# EAGLE design birthdaycontrol (EAGLE 6.5.0)
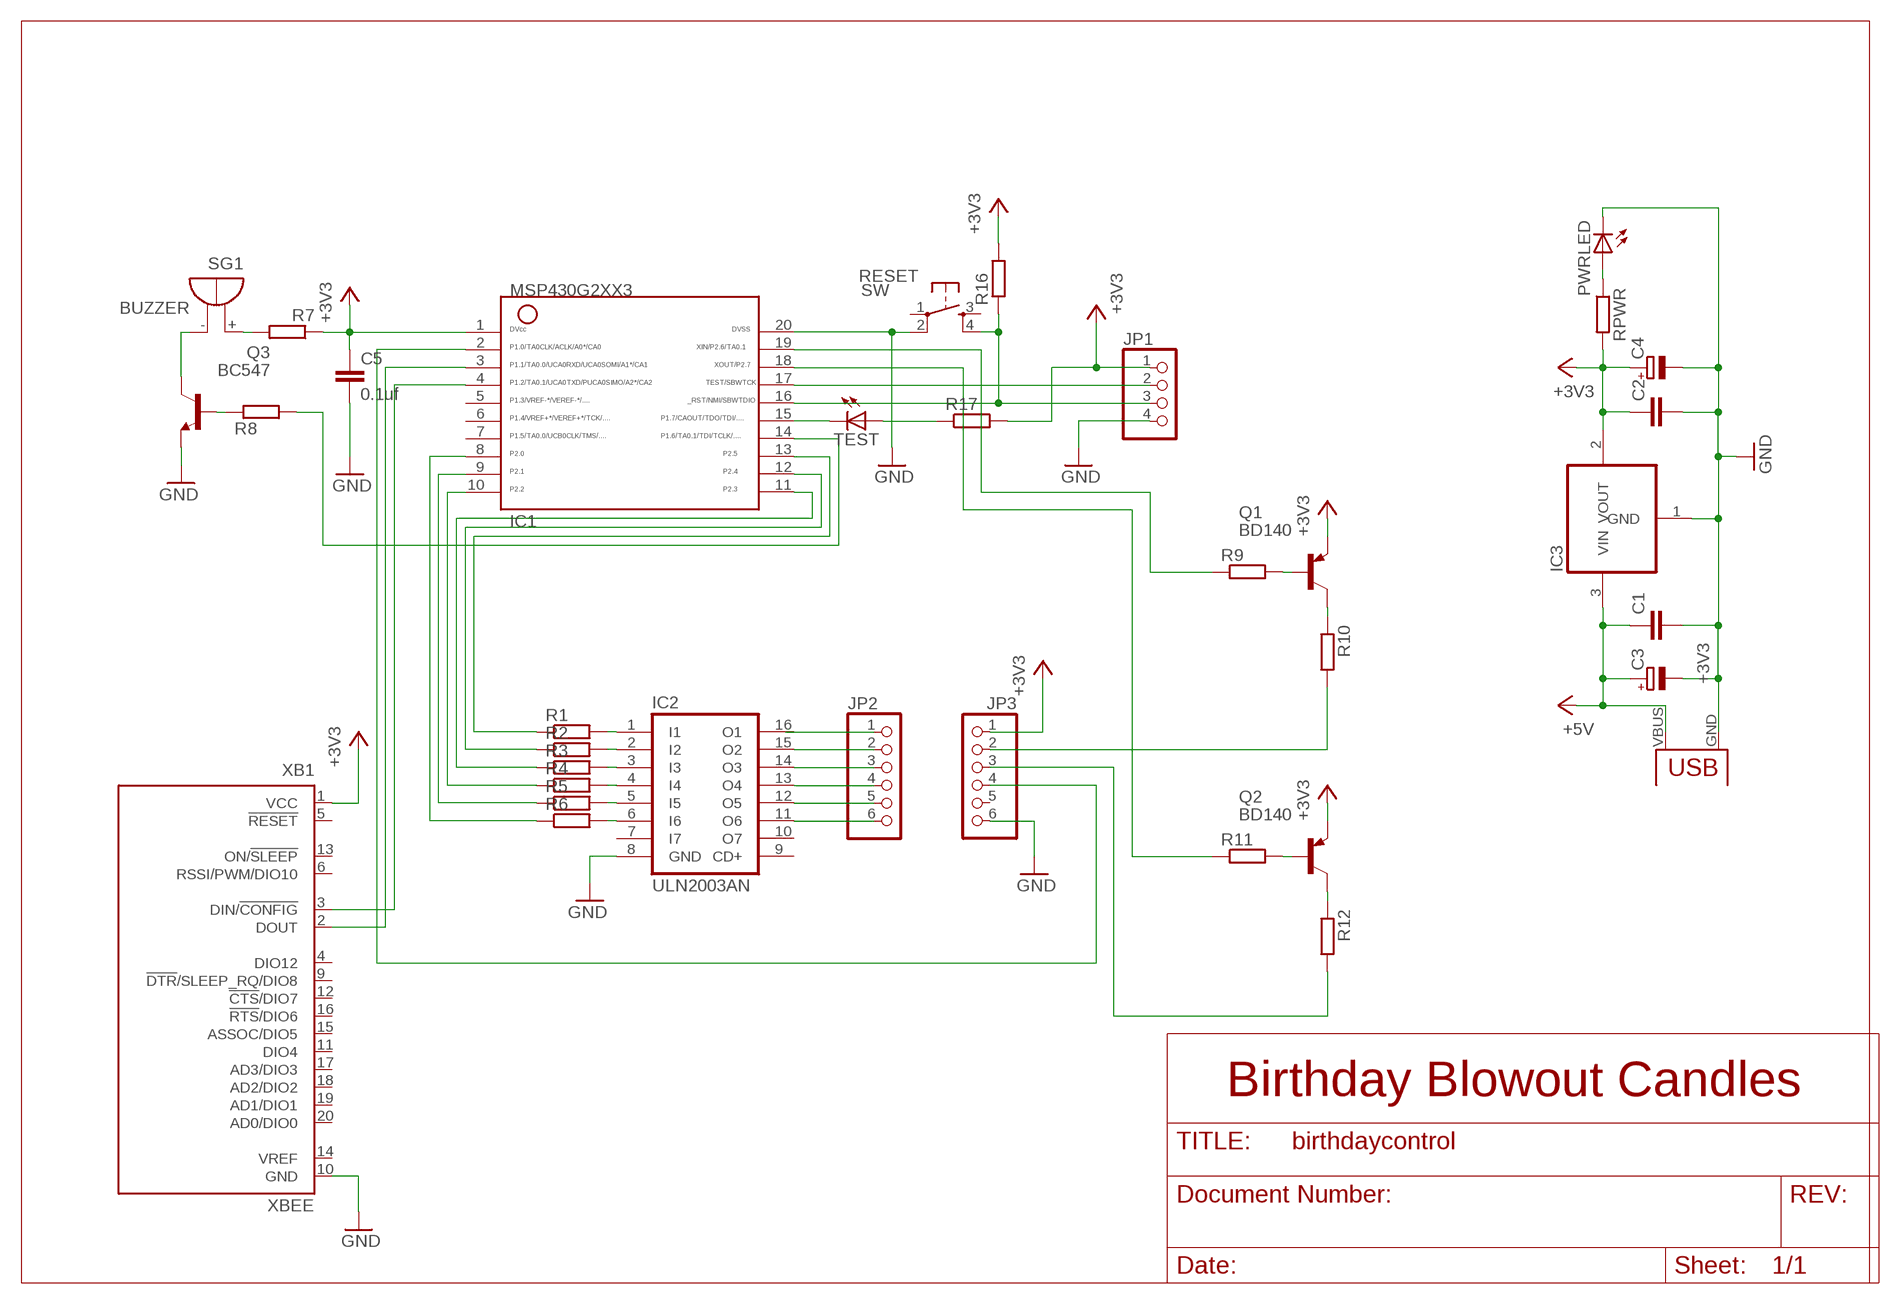
[diagram p0: schematic, sheet 1]

## Parts
C1  C-EU025-025X050  [C025-025X050]
C2  C-EU025-025X050  [C025-025X050]
C3  CPOL-EUE2.5-5  [E2,5-5]
C4  CPOL-EUE2.5-5  [E2,5-5]
C5  0.1uf  C-EU025-025X050  [C025-025X050]
IC1  MSP430  MSP430G2553DIP20  [G2553-DIP20]
IC2  ULN2003AN  [DIL16]
IC3  REG1117  [SOT223]
JP1  PINHD-1X4  [1X04]
JP2  PINHD-1X6  [1X06]
JP3  PINHD-1X6  [1X06]
PWRLED  LED3MM  [LED3MM]
Q1  BD140  [TO126]
Q2  BD140  [TO126]
Q3  BC547  [TO92]
R1  R-EU_0207/7  [0207/7]
R2  R-EU_0207/7  [0207/7]
R3  R-EU_0207/7  [0207/7]
R4  R-EU_0207/7  [0207/7]
R5  R-EU_0207/7  [0207/7]
R6  R-EU_0207/7  [0207/7]
R7  R-EU_0207/7  [0207/7]
R8  R-EU_0207/7  [0207/7]
R9  R-EU_0207/7  [0207/7]
R10  R-EU_0207/7  [0207/7]
R11  R-EU_0207/7  [0207/7]
R12  R-EU_0207/7  [0207/7]
R16  R-EU_0207/7  [0207/7]
R17  R-EU_0207/7  [0207/7]
RESET  SW  OMRON_SWITCH_10-XX  [B3F-10XX]
RPWR  R-EU_0207/7  [0207/7]
SG1  BUZZER  [F/TMB]
TEST  LED3MM  [LED3MM]
U$6  USB(POWER)  [USB(POWER)]
XB1  XBEE  [XBEE]

## Nets
+3V3: C2.1 C4.+ C5.1 IC1.1 IC3.2(VOUT) JP1.1 JP3.1 Q1.1(E) Q2.1(E) R7.1 R16.2 R17.2 RPWR.2 XB1.1(VCC)
+5V: C1.1 C3.+ IC3.3(VIN) U$6.VBUS(VCC)
GND: C1.2 C2.2 C3.- C4.- C5.2 IC1.20 IC2.8(GND) IC3.1(GND) JP1.4 JP3.6 PWRLED.K(C) Q3.1(E) RESET.2(P1) U$6.GND XB1.10(GND)
N$1: IC1.18 R11.1
N$2: IC1.3 XB1.2(DOUT)
N$3: IC2.1(I1) R1.2
N$4: IC2.2(I2) R2.2
N$5: Q1.3(B) R9.2
N$6: Q1.2(C) R10.1
N$7: IC1.15 TEST.K(C)
N$8: R17.1 TEST.A
N$9: IC2.3(I3) R3.2
N$10: Q3.3(C) SG1.-
N$11: IC2.4(I4) R4.2
N$12: R7.2 SG1.+
N$13: IC2.5(I5) R5.2
N$14: IC2.6(I6) R6.2
N$15: IC1.8 R6.1
N$16: IC1.9 R5.1
N$17: IC1.10 R4.1
N$18: IC1.11 R3.1
N$19: Q3.2(B) R8.1
N$20: IC1.12 R2.1
N$21: IC1.13 R1.1
N$22: Q2.3(B) R11.2
N$23: Q2.2(C) R12.1
N$24: IC2.13(O4) JP2.4
N$25: IC1.4 XB1.3(DIN/!CONFIG)
N$26: IC2.16(O1) JP2.1
N$27: IC2.12(O5) JP2.5
N$29: IC1.2 JP3.4
N$31: PWRLED.A RPWR.1
N$35: IC2.15(O2) JP2.2
N$37: IC2.14(O3) JP2.3
N$40: JP3.3 R12.2
N$41: IC2.11(O6) JP2.6
N$43: JP3.2 R10.2
N$68: IC1.19 R9.1
P1.2: IC1.14 R8.2
RST: IC1.16 JP1.3 R16.1 RESET.4(S1)
TEST: IC1.17 JP1.2
Unconnected: IC1.5 IC1.6 IC1.7 IC2.7(I7) IC2.9(CD+) IC2.10(O7) JP3.5 RESET.1(P) RESET.3(S) XB1.4(DIO12) XB1.5(!RESET) XB1.6(RSSI/PWM/DIO10) XB1.9(!DTR!/SLEEP_RQ/DIO8) XB1.11(DIO4) XB1.12(!CTS!/DIO7) XB1.13(ON/!SLEEP) XB1.14(VREF) XB1.15(ASSOC/DIO5) XB1.16(!RTS!/DIO6) XB1.17(AD3/DIO3) XB1.18(AD2/DIO2) XB1.19(AD1/DIO1) XB1.20(AD0/DIO0)

## Notes on the sheet
- Birthday Blowout Candles

## Library data of the parts
C1 C2 C5 = rcl:C-EU: CAPACITOR, European symbol
C3 C4 = resistor:CPOL-EU: POLARIZED CAPACITOR, European symbol
IC1 = CEDT_JANUARY_2015_v5:MSP430G2553
IC2 = uln-udn:ULN2003A: DRIVER ARRAY
IC3 = burr-brown:REG1117: 800mA and 1A Low Dropout (LDO) Positive Regulator 1.8V, 2.5V, 2.85V, 3.3V, 5V, and Adj; MPN: REG1117; OC_FARNELL: 1097566; OC_NEWARK: 14P6981
JP1 = pinhead01:PINHD-1X4: PIN HEADER
JP2 JP3 = pinhead01:PINHD-1X6: PIN HEADER
PWRLED TEST = led:LED: LED OSRAM: - CHIPLED LG R971, LG N971, LY N971, LG Q971, LY Q971, LO R971, LY R971 LH N974, LH R974 LS Q976, LO Q976, LY Q976 LO Q996 - Hyper CHIPLED LW Q18S LB Q993, LB Q99A, LB R99A - SideLED LS A670, LO A670, LY A670, LG A670, LP A670 LB A673, LV A673, LT A673, LW A673 LH A674 LY A675 LS A676, LA A676, LO A676, LY A676, LW A676 LS A679, LY A679, LG A679 - Hyper Micro SIDELED® LS Y876, LA Y876, LO Y876, LY Y876 LT Y87S - SmartLED LW L88C, LW L88S LB L89C, LB L89S, LG L890 LS L89K, LO L89K, LY L89K LS L896, LA L896, LO L896, LY L896 - TOPLED LS T670, LO T670, LY T670, LG T670, LP T670 LSG T670, LSP T670, LSY T670, LOP T670, LYG T670 LG T671, LOG T671, LSG T671 LB T673, LV T673, LT T673, LW T673 LH T674 LS T676, LA T676, LO T676, LY T676, LB T676, LH T676, LSB T676, LW T676 LB T67C, LV T67C, LT T67C, LS T67K, LO T67K, LY T67K, LW E67C LS E67B, LA E67B, LO E67B, LY E67B, LB E67C, LV E67C, LT E67C LW T67C LS T679, LY T679, LG T679 LS T770, LO T770, LY T770, LG T770, LP T770 LB T773, LV T773, LT T773, LW T773 LH T774 LS E675, LA E675, LY E675, LS T675 LS T776, LA T776, LO T776, LY T776, LB T776 LHGB T686 LT T68C, LB T68C - Hyper Mini TOPLED® LB M676 - Mini TOPLED Santana® LG M470 LS M47K, LO M47K, LY M47K Source: http://www.osram.convergy.de LUXEON: - LUMILED® LXK2-PW12-R00, LXK2-PW12-S00, LXK2-PW14-U00, LXK2-PW14-V00 LXK2-PM12-R00, LXK2-PM12-S00, LXK2-PM14-U00 LXK2-PE12-Q00, LXK2-PE12-R00, LXK2-PE12-S00, LXK2-PE14-T00, LXK2-PE14-U00 LXK2-PB12-K00, LXK2-PB12-L00, LXK2-PB12-M00, LXK2-PB14-N00, LXK2-PB14-P00, LXK2-PB14-Q00 LXK2-PR12-L00, LXK2-PR12-M00, LXK2-PR14-Q00, LXK2-PR14-R00 LXK2-PD12-Q00, LXK2-PD12-R00, LXK2-PD12-S00 LXK2-PH12-R00, LXK2-PH12-S00 LXK2-PL12-P00, LXK2-PL12-Q00, LXK2-PL12-R00 Source: www.luxeon.com KINGBRIGHT: KA-3528ASYC Source: www.kingbright.com
Q1 Q2 = transistor-pnp:BD140: PNP Transistor
Q3 = transistor:BC547: NPN TRANSISTOR
R1-R6 = resistor:R-EU_: RESISTOR, European symbol
R7-R12 R16 R17 RPWR = rcl:R-EU_: RESISTOR, European symbol
RESET = CEDT_JANUARY_2015_v5:OMRON_SWITCH
SG1 = CEDT_JANUARY_2015_v5:BUZZER: BUZZER Source: Buerklin; OC_FARNELL: unknown; OC_NEWARK: unknown
U$6 = CEDT_JANUARY_2015_v5:USB(POWER)
XB1 = xbee:XBEE: XBee (TM) /XBee-PRO(TM) OEM RF Modules Source: MaxStream, Inc. xbee_productmanual.pdf; MPN: XBP24-Z7UIT-004; OC_FARNELL: 1751799; OC_NEWARK: 34R5507

## Board
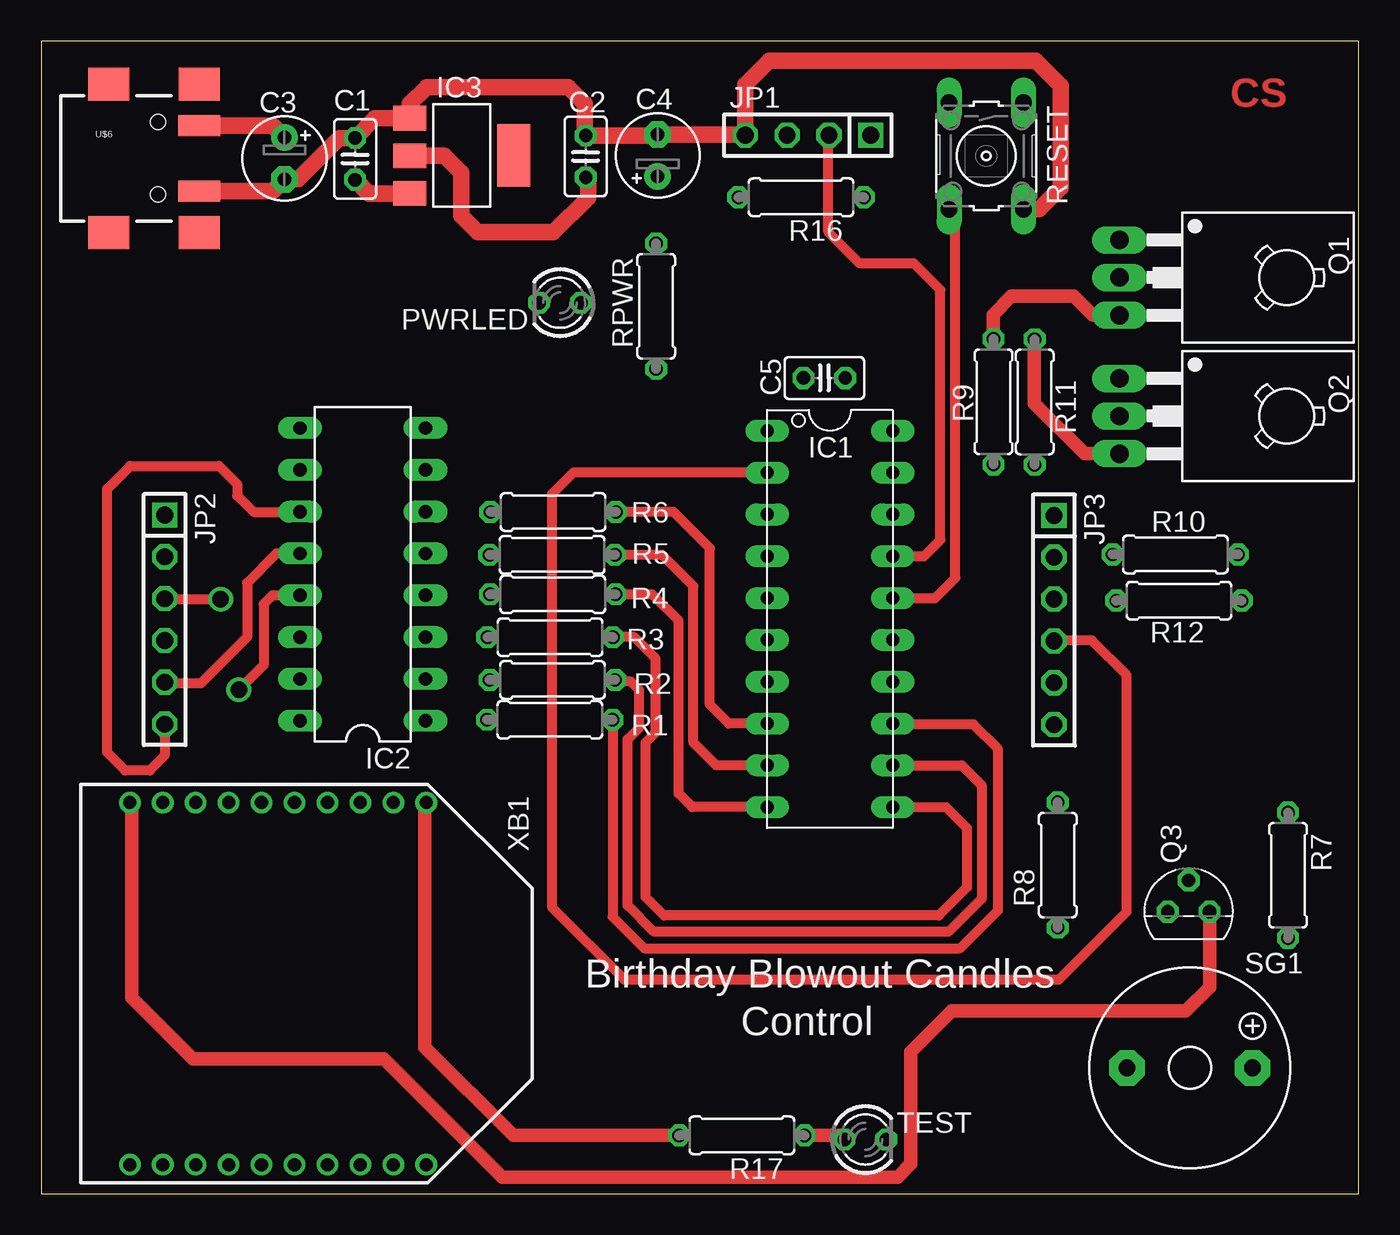
[diagram p1: board, top side]
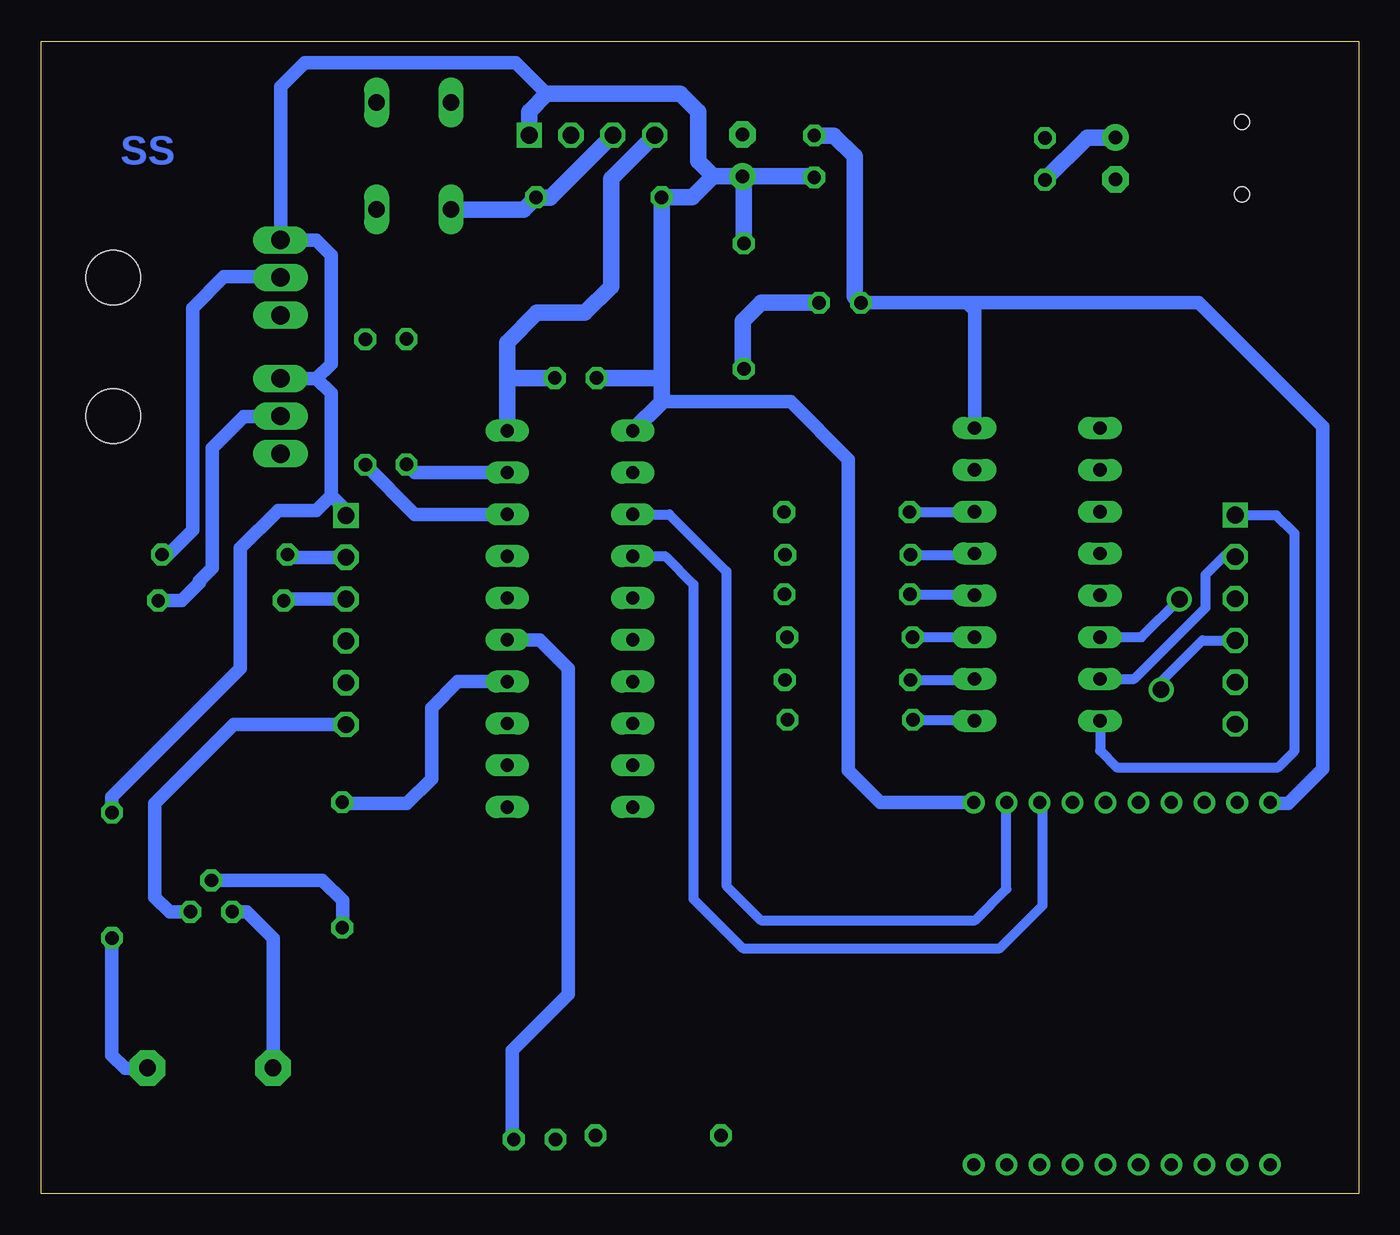
[diagram p2: board, bottom side, seen from below]

Size 80 x 70 mm. Coordinates in mm from the lower left corner, seen from the top.
Outline: 0,0 80,0 80,70 0,70 0,0
Copper layers (1*16): Top 0.035mm / dielectric 1.5mm / Bottom 0.035mm
Design rules "default *": minimum track width 10mil, minimum drill 24mil, track to track 8mil, track to pad 8mil, pad to pad 8mil, via to via 8mil, smd to smd 8mil, copper to edge 20mil, drill to drill 8mil, minimum pad ring 10mil, minimum via ring 8mil, stop-mask expansion 4mil, vias tented up to drill 0mil, thermal gap 10mil

### Footprints (pad centres in the part's own frame; a part is rotated, then mirrored left to right if it is on the bottom)
C025-025X050 = drill 0.813 octagon: 1 -1.27,0; 2 1.27,0
E2,5-5 = drill 0.813 pad 1.6: + -1.27,0 | drill 0.813 pad 1.6 octagon: - 1.27,0
G2553-DIP20 = drill 0.813 long: 1 -10.165,-3.81; 2 -7.625,-3.81; 3 -5.085,-3.81; 4 -2.545,-3.81; 5 -0.005,-3.81; 6 2.535,-3.81; 7 5.075,-3.81; 8 7.615,-3.81; 9 10.155,-3.81; 10 12.695,-3.81; 11 12.695,3.81; 12 10.155,3.81; 13 7.615,3.81; 14 5.075,3.81; 15 2.535,3.81; 16 -0.005,3.81; 17 -2.545,3.81; 18 -5.085,3.81; 19 -7.625,3.81; 20 -10.165,3.81
DIL16 = drill 0.813 long: 1 -8.89,-3.81; 2 -6.35,-3.81; 3 -3.81,-3.81; 4 -1.27,-3.81; 5 1.27,-3.81; 6 3.81,-3.81; 7 6.35,-3.81; 8 8.89,-3.81; 9 8.89,3.81; 10 6.35,3.81; 11 3.81,3.81; 12 1.27,3.81; 13 -1.27,3.81; 14 -3.81,3.81; 15 -6.35,3.81; 16 -8.89,3.81
SOT223 = smd 1.499 x 2.007: 1 -2.261,-3.15; 2 0.025,-3.15; 3 2.311,-3.15 | smd 3.81 x 2.007: 4 0,3.15
1X04 = drill 1.016 square: 1 -3.81,0 | drill 1.016 octagon: 2 -1.27,0; 3 1.27,0; 4 3.81,0
1X06 = drill 1.016 square: 1 -6.35,0 | drill 1.016 octagon: 2 -3.81,0; 3 -1.27,0; 4 1.27,0; 5 3.81,0; 6 6.35,0
LED3MM = drill 0.813 octagon: A -1.27,0; K 1.27,0
TO126 = drill 1.118 long: 1 -2.286,-5.08; 2 0,-5.08; 3 2.286,-5.08 | hole 3.302: 0,5.08
TO92 = drill 0.813 octagon: 1 1.27,0; 2 0,1.905; 3 -1.27,0
0207/7 = drill 0.813 octagon: 1 -3.81,0; 2 3.81,0
B3F-10XX = drill 1.016 long: 1 -3.251,2.261; 2 3.251,2.261; 3 -3.251,-2.261; 4 3.251,-2.261
F/TMB = drill 1.016 pad 2.159 octagon: + 3.81,0; - -3.81,0
USB(POWER) = smd 2.54 x 1.27: GND 2.5,-1.981; VBUS 2.5,1.981 | smd 2.5 x 2: GND@1 -3,-4.5; GND@2 -3,4.5; GND@3 2.5,4.5; GND@4 2.5,-4.5 | hole 0.9: 0,2.2; 0,-2.2
XBEE = drill 0.8 pad 1.27: 1 -11,9; 2 -11,7; 3 -11,5; 4 -11,3; 5 -11,1; 6 -11,-1; 7 -11,-3; 8 -11,-5; 9 -11,-7; 10 -11,-9; 11 11,-9; 12 11,-7; 13 11,-5; 14 11,-3; 15 11,-1; 16 11,1; 17 11,3; 18 11,5; 19 11,7; 20 11,9

### Placement (x,y rotation side)
C1  19.06,62.85 90 top
C2  33.06,63 90 top
C3  14.77,62.88 270 top
C4  37.43,63.06 90 top
C5  47.55,49.54 0 top
IC1  47.89,36.17 270 top
IC2  19.52,37.61 90 top
IC3  25.54,63.06 270 top
JP1  46.56,64.29 180 top
JP2  7.5,34.87 270 top
JP3  61.49,34.84 270 top
PWRLED  31.5,54.11 180 top
Q1  70.54,55.64 270 top
Q2  70.54,47.23 270 top
Q3  69.67,17.12 0 top
R1  30.88,28.78 180 top
R2  31.04,31.2 180 top
R3  30.9,33.8 180 top
R4  31.06,36.4 180 top
R5  31.02,38.8 180 top
R6  31.08,41.4 180 top
R7  75.7,19.34 270 top
R8  61.72,19.96 90 top
R9  57.82,48.1 90 top
R10  68.86,38.82 180 top
R11  60.32,48.08 90 top
R12  69.08,36.02 180 top
R16  46.14,60.52 180 top
R17  42.54,3.54 180 top
RESET  57.38,63.03 270 top
RPWR  37.34,53.9 90 top
SG1  69.74,7.64 0 top
TEST  50.04,3.29 0 top
U$6  7.1,62.88 0 top
XB1  14.38,12.76 270 top

### Tracks (layer width: path | path; a pad name or v marks a point on that pad's centre or on a via)
+3V3
  Top 0.813: R17.2 28.66,3.54 23.3,8.9 23.3,23.68 XB1.1
  Top 1.016: IC3.2 24.46,63.03 25.5,62 25.5,59.4 26.5,58.4 31.1,58.4 33.2,60.5 33.2,61.59 C2.1
  Bottom 0.813: XB1.1 29.06,23.76 31,25.7 31,44.6 34.5,48.1 42.31,48.1 42.33,48.09 | 49.3,66.8 51.2,68.7 64,68.7 65.46,67.24 Q1.1 65.43,57.9 63.3,57.9 62.4,57 62.4,50.4 63.28,49.52 | Q2.1 63.28,49.52 | JP3.1 61.49,41.49 62.4,42.4 | 62.4,42.4 62.4,48.63 63.28,49.52 | R7.1 75.7,24.1 67.9,31.9 67.9,39.2 65.6,41.5 63.3,41.5 62.4,42.4
  Bottom 1.016: JP1.1 50.37,65.73 49.3,66.8 41.2,66.8 40.1,65.7 40.1,62.7 39.2,61.8 | 39.2,61.8 40.48,60.52 R16.2 42.33,49.5 | 42.33,49.5 42.33,48.09 IC1.1 | C5.1 42.37,49.54 42.33,49.5 | 39.2,61.8 C4.+ | C4.+ 33.12,61.79 C2.1 | RPWR.2 37.34,61.7 C4.+
+5V
  Top 1.016: U$6.VBUS 14.06,64.86 C3.+ | IC3.3 19.89,60.75 C1.1
  Bottom 1.016: C3.+ 16.49,64.15 C1.1
GND
  Top 0.813: Q3.1 70.94,12.54 69.5,11.1 55.3,11.1 52.8,8.6 52.8,1.8 52,1 28,1 20.8,8.2 9.2,8.2 5.5,11.9 5.5,23.64 XB1.10
  Top 1.016: U$6.GND 14.06,60.9 C3.- 15.61,61.61 18.1,64.1 19.04,64.1 C1.2 20.26,65.32 IC3.1 22.39,66.19 23.4,67.2 32,67.2 33,66.2 33,64.33 C2.2 37.37,64.27 C4.- 42.71,64.33 JP1.4 42.75,67.35 44.2,68.8 60.4,68.8 61.9,67.3 61.9,61.1 60.6,59.8 59.66,59.8 RESET.2
  Bottom 0.813: PWRLED.K 23.8,54.11 | 23.8,54.11 9.71,54.11 2.2,46.6 2.2,25.8 4.3,23.7 5.44,23.7 XB1.10 | IC2.8 23.33,53.64 23.8,54.11 | JP3.6 68.31,28.49 73.1,23.7 73.1,18 72.2,17.1 70.96,17.1 Q3.1
  Bottom 1.016: C2.2 31.87,64.27 30.6,63 30.6,54.48 PWRLED.K | IC1.20 51.7,49.4 | 51.7,49.4 51.7,51.7 49.9,53.5 47,53.5 45.4,55.1 45.4,61.64 JP1.4 | C5.2 51.56,49.54 51.7,49.4
N$1
  Bottom 0.813: IC1.18 57.3,41.26 R11.1
N$2
  Bottom 0.61: IC1.3 41.85,41.26 38.4,37.8 38.4,18.7 36.3,16.6 23.3,16.6 21.4,18.5 21.4,23.74 XB1.2
N$3
  Bottom 0.61: R1.2 23.39,28.78 IC2.1
N$4
  Bottom 0.61: R2.2 23.39,31.2 IC2.2
N$5
  Top 0.813: Q1.3 63.85,53.35 62.7,54.5 58.9,54.5 57.8,53.4 57.8,51.93 R9.2
N$6
  Bottom 0.813: R10.1 72.28,38.82 70.8,40.3 70.8,53.8 68.9,55.7 65.52,55.7 Q1.2
N$7
  Bottom 0.813: IC1.15 49.73,33.63 48,31.9 48,12.1 51.4,8.7 51.4,3.38 TEST.K
N$8
  Top 0.813: R17.1 48.52,3.54 TEST.A
N$9
  Bottom 0.61: R3.2 IC2.3
N$10
  Bottom 0.813: Q3.3 67.52,17.12 65.9,15.5 65.9,7.67 SG1.-
N$11
  Bottom 0.61: R4.2 23.39,36.4 IC2.4
N$12
  Bottom 0.813: R7.2 75.7,8.4 74.9,7.6 73.59,7.6 SG1.+
N$13
  Bottom 0.61: R5.2 23.41,38.8 IC2.5
N$14
  Bottom 0.61: R6.2 23.35,41.4 IC2.6
N$15
  Top 0.61: IC1.8 41.74,28.55 40.6,29.7 40.6,39.2 38.4,41.4 R6.1
N$16
  Top 0.61: IC1.9 40.98,26.02 39.6,27.4 39.6,36.9 37.7,38.8 R5.1
N$17
  Top 0.61: IC1.10 39.52,23.48 38.7,24.3 38.7,34.8 37.1,36.4 R4.1
N$18
  Top 0.61: IC1.11 54.92,23.48 56.2,22.2 56.2,18.6 54.5,16.9 37.8,16.9 36.7,18 36.7,27.4 37.3,28 37.3,32.5 36,33.8 R3.1
N$19
  Bottom 0.813: Q3.2 62.92,19.02 61.7,17.8 61.7,16.17 R8.1
N$20
  Top 0.61: IC1.12 55.88,26.02 57.1,24.8 57.1,17.9 55.1,15.9 37.2,15.9 35.6,17.5 35.6,27.6 36.3,28.3 36.3,30.6 35.8,31.1 34.95,31.1 R2.1
N$21
  Top 0.61: R1.1 34.69,16.81 36.6,14.9 55.8,14.9 58.1,17.2 58.1,27 56.6,28.5 51.76,28.5 IC1.13
N$22
  Top 0.813: Q2.3 63.36,44.94 60.3,48 60.3,51.87 R11.2
N$23
  Bottom 0.813: R12.1 71.48,36.02 70.4,37.1 70.4,37.2 69.6,38 69.6,45.3 67.7,47.2 65.49,47.2 Q2.2
N$24  (via drill 1)
  Top 0.61: IC2.13 14.04,36.34 13.5,35.8 13.5,32.1 v12,30.6
  Bottom 0.61: v12,30.6 12,31.1 9.5,33.6 JP2.4
N$25
  Bottom 0.61: IC1.4 42.12,38.72 40.4,37 40.4,17.9 37.4,14.9 21.8,14.9 19.2,17.5 19.2,23.58 XB1.3
N$26
  Bottom 0.61: IC2.16 15.71,26.91 14.7,25.9 4.9,25.9 3.9,26.9 3.9,40.1 5,41.2 7.48,41.2 JP2.1
N$27
  Top 0.61: IC2.12 14.28,38.88 12.5,37.1 12.5,33.8 9.7,31 7.56,31 JP2.5
N$29
  Top 0.61: IC1.2 32.3,43.8 31,42.5 31,17.4 35.4,13 61.8,13 65.9,17.1 65.9,31.5 63.8,33.6 61.52,33.6 JP3.4
N$31
  Bottom 1.016: PWRLED.A 36.29,54.11 37.4,53 37.4,50.15 RPWR.1
N$35
  Bottom 0.61: IC2.15 13.64,31.26 9.3,35.6 9.3,37.6 8.2,38.7 7.52,38.7 JP2.2
N$37  (via drill 1)
  Top 0.61: v10.9,36.1 7.54,36.1 JP2.3
  Bottom 0.61: IC2.14 13.2,33.8 v10.9,36.1
N$40
  Bottom 0.813: JP3.3 65.18,36.11 R12.2
N$41
  Top 0.61: JP2.6 7.5,26.6 6.6,25.7 5.1,25.7 4,26.8 4,42.8 5.4,44.2 10.8,44.2 11.9,43.1 11.9,42.4 12.9,41.4 15.69,41.4 IC2.11
N$43
  Bottom 0.813: JP3.2 64.88,38.65 R10.2
N$68
  Bottom 0.813: IC1.19 57.33,43.8 R9.1
P1.2
  Bottom 0.813: IC1.14 54.7,31.09 56.3,29.5 56.3,25.2 57.8,23.7 61.65,23.7 R8.2
RST
  Top 0.61: IC1.16 54.27,36.17 55.5,37.4 55.5,59.4 RESET.4
  Bottom 1.016: RESET.4 50.69,59.78 R16.1 49.93,60.5 49.1,60.5 45.31,64.29 JP1.3
TEST
  Top 0.61: IC1.17 53.62,38.72 54.6,39.7 54.6,54.9 53,56.5 49.7,56.5 47.8,58.4 47.8,64.26 JP1.2

### Text on the board
Top: CS
Bottom: SS
tNames: Birthday Blowout Candles | Control